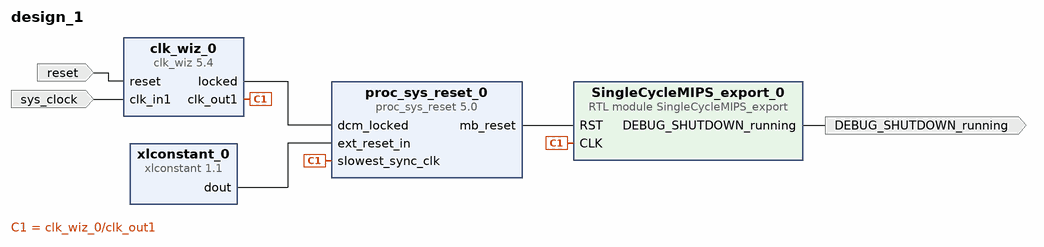
[diagram p0: block diagram of the top level]
# Vivado block design design_1, xc7z020clg484-1, Vivado 2017.1
create_bd_design design_1

create_bd_port -dir I -type rst reset
set_property -dict {CONFIG.POLARITY ACTIVE_HIGH} [get_bd_ports reset]
create_bd_port -dir O DEBUG_SHUTDOWN_running
create_bd_port -dir I -type clk sys_clock
set_property -dict {CONFIG.FREQ_HZ 100000000 CONFIG.PHASE 0.000} [get_bd_ports sys_clock]

create_bd_cell -type ip -vlnv xilinx.com:ip:clk_wiz:5.4 clk_wiz_0
set_property -dict [list \
  CONFIG.CLKOUT1_REQUESTED_OUT_FREQ 10 \
  CONFIG.MMCM_DIVCLK_DIVIDE 2 \
  CONFIG.MMCM_CLKFBOUT_MULT_F 15.625 \
  CONFIG.MMCM_CLKOUT0_DIVIDE_F 78.125 \
  CONFIG.USE_BOARD_FLOW true \
  CONFIG.CLK_IN1_BOARD_INTERFACE sys_clock \
  CONFIG.CLKOUT1_JITTER 290.478 \
  CONFIG.CLKOUT1_PHASE_ERROR 133.882 \
] [get_bd_cells clk_wiz_0]
create_bd_cell -type ip -vlnv xilinx.com:ip:proc_sys_reset:5.0 proc_sys_reset_0
create_bd_cell -type ip -vlnv xilinx.com:ip:xlconstant:1.1 xlconstant_0
set_property -dict {CONFIG.CONST_VAL 0} [get_bd_cells xlconstant_0]
create_bd_cell -type module -reference SingleCycleMIPS_export SingleCycleMIPS_export_0

# ---- connections ----

connect_bd_net [get_bd_pins clk_wiz_0/clk_out1] [get_bd_pins proc_sys_reset_0/slowest_sync_clk] [get_bd_pins SingleCycleMIPS_export_0/CLK]
connect_bd_net [get_bd_pins proc_sys_reset_0/mb_reset] [get_bd_pins SingleCycleMIPS_export_0/RST]
connect_bd_net [get_bd_ports reset] [get_bd_pins clk_wiz_0/reset]
connect_bd_net [get_bd_pins SingleCycleMIPS_export_0/DEBUG_SHUTDOWN_running] [get_bd_ports DEBUG_SHUTDOWN_running]
connect_bd_net [get_bd_ports sys_clock] [get_bd_pins clk_wiz_0/clk_in1]
connect_bd_net [get_bd_pins clk_wiz_0/locked] [get_bd_pins proc_sys_reset_0/dcm_locked]
connect_bd_net [get_bd_pins xlconstant_0/dout] [get_bd_pins proc_sys_reset_0/ext_reset_in]

validate_bd_design
save_bd_design
